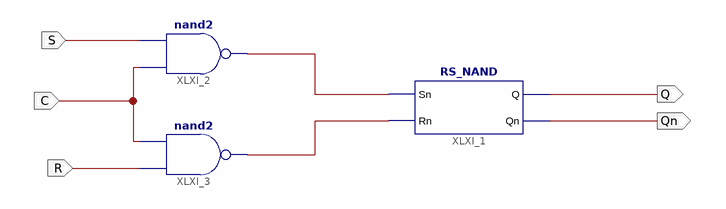
[diagram p0: schematic sheet 1]
// Xilinx ISE schematic RS_EN.sch (spartan3) as structural Verilog: 3 symbols, 5 ports
module RS_EN (
  input  C,
  input  S,
  input  R,
  output Q,
  output Qn
);

  wire XLXN_4, XLXN_5;

  RS_NAND XLXI_1 (.Sn(XLXN_4), .Rn(XLXN_5), .Q(Q), .Qn(Qn));
  nand XLXI_2 (XLXN_4, C, S);
  nand XLXI_3 (XLXN_5, R, C);
endmodule
